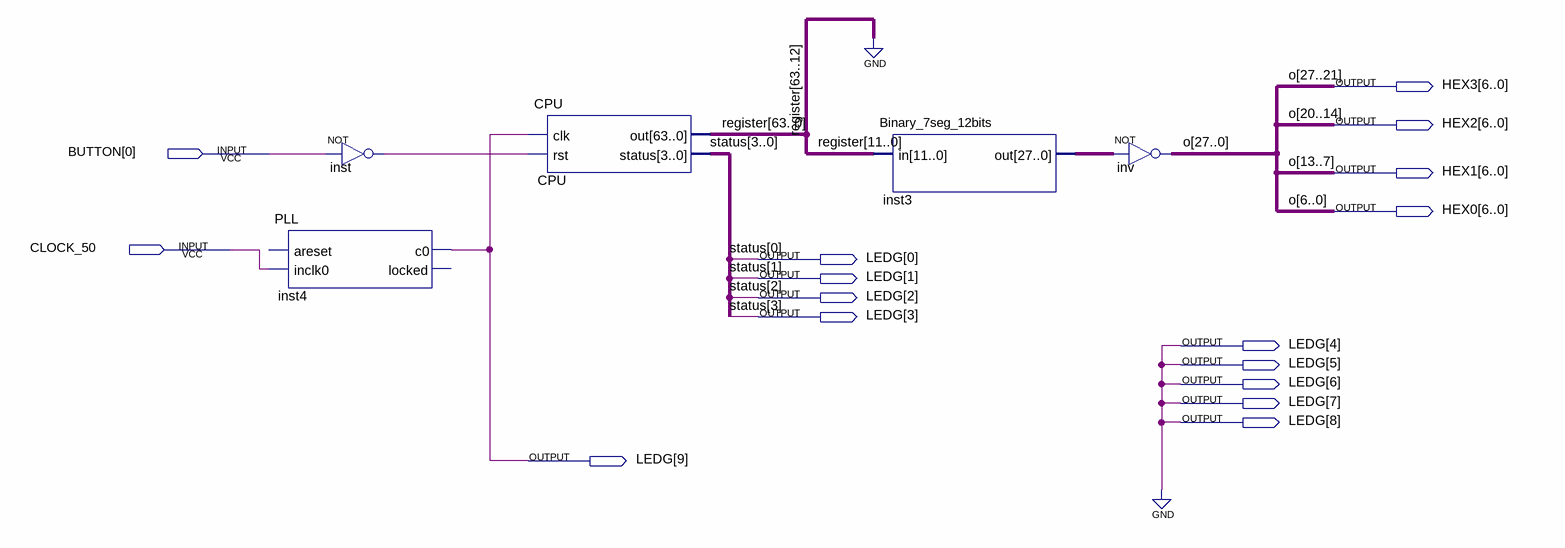
[diagram p0: schematic sheet]
// Quartus schematic Fib.bdf as structural Verilog: 5 symbols, 16 pins
module Fib (
  input  [0:0] BUTTON,
  input  CLOCK_50,
  output [6:0] HEX3,
  output [6:0] HEX2,
  output [6:0] HEX1,
  output [6:0] HEX0,
  output [9:0] LEDG
);

  wire inst_out;
  wire [27:0] inst3_out;
  wire [63:0] register;

  not inst (inst_out, BUTTON[0]);
  PLL inst4 (.inclk0(CLOCK_50), .c0(LEDG[9]));  // open: areset, locked
  CPU CPU (.clk(LEDG[9]), .rst(inst_out), .out(register), .status(LEDG[3:0]));
  Binary_7seg_12bits inst3 (.in(register[11:0]), .out(inst3_out));
  assign {HEX3, HEX2, HEX1, HEX0} = ~inst3_out;  // NOT inv, 28 bits wide

  assign LEDG[8:4] = {5{1'b0}};
  // also tied to GND on the sheet: {register[12], register[13], register[14], register[15], register[16], register[17], register[18], register[19], register[20], register[21], register[22], register[23], register[24], register[25], register[26], register[27], register[28], register[29], register[30], register[31], register[32], register[33], register[34], register[35], register[36], register[37], register[38], register[39], register[40], register[41], register[42], register[43], register[44], register[45], register[46], register[47], register[48], register[49], register[50], register[51], register[52], register[53], register[54], register[55], register[56], register[57], register[58], register[59], register[60], register[61], register[62], register[63]}

  // Other names for the same wires on the sheet: o[27:0] = {HEX3, HEX2, HEX1, HEX0}; status[3:0] = LEDG[3:0]
endmodule
